# EAGLE design ProtoShield_V4.0 (EAGLE 7.6.0)
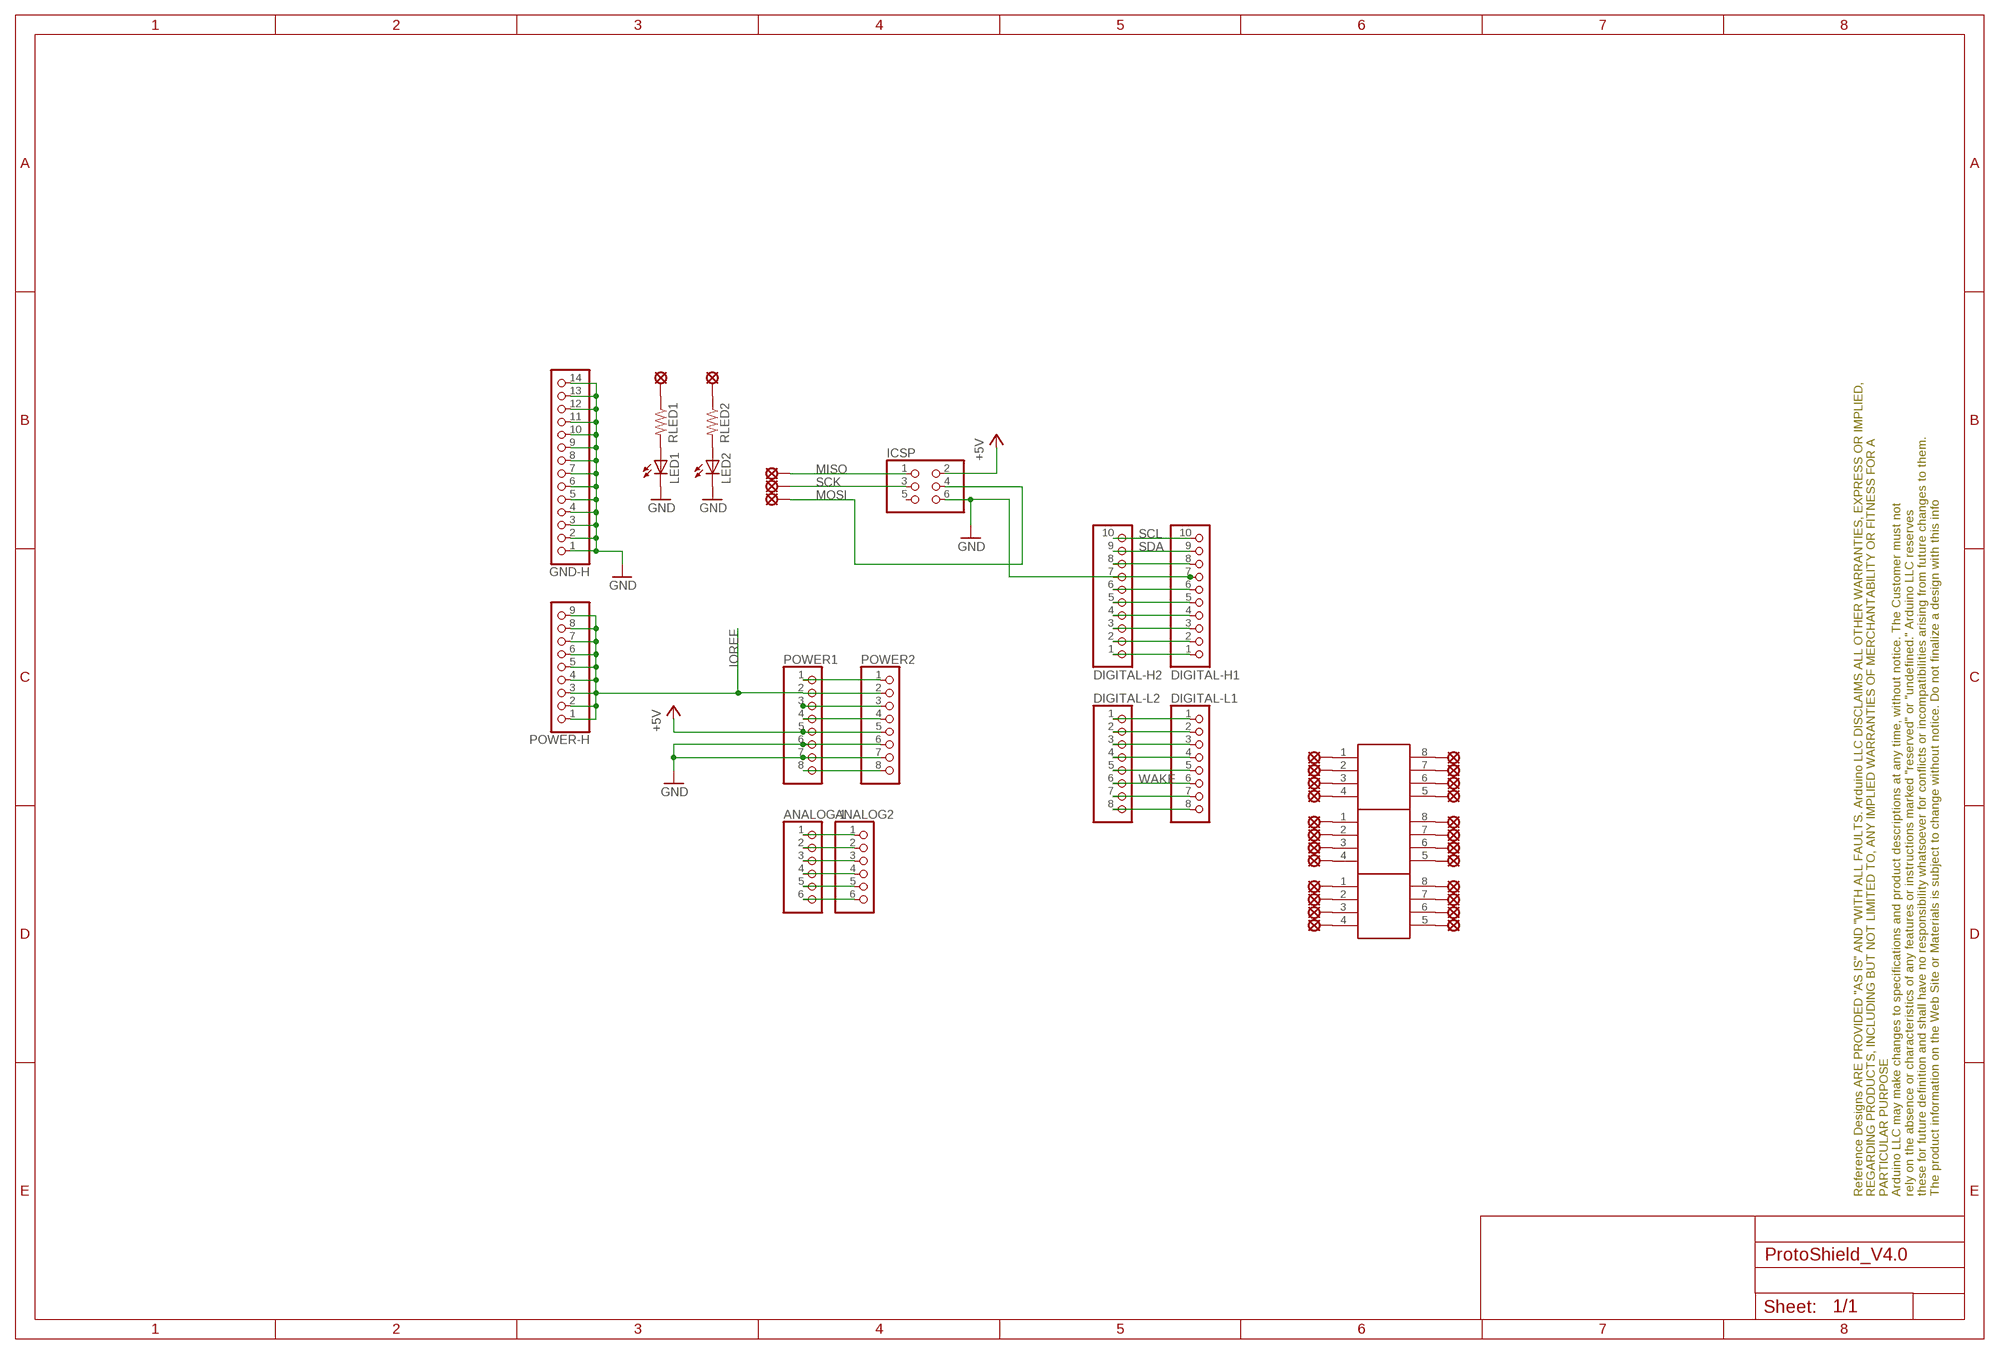
[diagram p0: schematic, sheet 1]

## Parts
ANALOG2  PINHD-1X6  [1X06]
ANALOG-1  PINHD-1X6  [1X06]
DIGITAL-H1  PINHD-1X10TH  [1X10-TH]
DIGITAL-H2  PINHD-1X10TH  [1X10-TH]
DIGITAL-L1  PINHD-1X8  [1X08]
DIGITAL-L2  PINHD-1X8  [1X08]
FRAME1  A3L-LOC  [FRAME]
GND-H  PINHD-1X14  [1X14]
IC1  SMD-8  [SO-8]
IC2  SMD-8  [SO-8]
IC3  SMD-8  [SO-8]
ICSP  PINHD-2X3  [2X03]
LED1  LED3MM  [LED3MM]
LED2  LED3MM  [LED3MM]
MISO  LSP10  [LSP10]
MOSI  LSP10  [LSP10]
P1  LSP10  [LSP10]
P2  LSP10  [LSP10]
P3  LSP10  [LSP10]
P4  LSP10  [LSP10]
P5  LSP10  [LSP10]
P6  LSP10  [LSP10]
P7  LSP10  [LSP10]
P8  LSP10  [LSP10]
P9  LSP10  [LSP10]
P10  LSP10  [LSP10]
P11  LSP10  [LSP10]
P12  LSP10  [LSP10]
P13  LSP10  [LSP10]
P14  LSP10  [LSP10]
P15  LSP10  [LSP10]
P16  LSP10  [LSP10]
P17  LSP10  [LSP10]
P18  LSP10  [LSP10]
P19  LSP10  [LSP10]
P20  LSP10  [LSP10]
P21  LSP10  [LSP10]
P22  LSP10  [LSP10]
P23  LSP10  [LSP10]
P24  LSP10  [LSP10]
PLED1  LSP10  [LSP10]
PLED2  LSP10  [LSP10]
POWER1  PINHD-1X8TH  [1X08-TH]
POWER2  PINHD-1X8TH  [1X08-TH]
POWER-H  PINHD-1X9  [1X9]
RLED1  6MM.3  [R0207/3]
RLED2  6MM.3  [R0207/3]
SCK  LSP10  [LSP10]

## Nets
+5V: ICSP.2 POWER1.5 POWER2.5
GND: DIGITAL-H1.7 DIGITAL-H2.7 GND-H.1 GND-H.2 GND-H.3 GND-H.4 GND-H.5 GND-H.6 GND-H.7 GND-H.8 GND-H.9 GND-H.10 GND-H.11 GND-H.12 GND-H.13 GND-H.14 ICSP.6 LED1.K(C) LED2.K(C) POWER1.7 POWER2.7
IOREF: POWER1.2 POWER2.2 POWER-H.1 POWER-H.2 POWER-H.3 POWER-H.4 POWER-H.5 POWER-H.6 POWER-H.7 POWER-H.8 POWER-H.9
MISO: ICSP.1 MISO.MP
MOSI: ICSP.4 MOSI.MP
N$1: DIGITAL-H1.6 DIGITAL-H2.6
N$2: DIGITAL-H1.1 DIGITAL-H2.1
N$3: DIGITAL-H1.4 DIGITAL-H2.4
N$4: DIGITAL-H1.5 DIGITAL-H2.5
N$5: IC1.1 P1.MP
N$6: DIGITAL-H1.2 DIGITAL-H2.2
N$7: DIGITAL-H1.3 DIGITAL-H2.3
N$8: DIGITAL-L1.1 DIGITAL-L2.1
N$9: DIGITAL-L1.2 DIGITAL-L2.2
N$10: DIGITAL-L1.3 DIGITAL-L2.3
N$11: DIGITAL-L1.4 DIGITAL-L2.4
N$12: DIGITAL-L1.5 DIGITAL-L2.5
N$14: DIGITAL-L1.7 DIGITAL-L2.7
N$15: DIGITAL-L1.8 DIGITAL-L2.8
N$18: ANALOG2.1 ANALOG-1.1
N$19: ANALOG2.2 ANALOG-1.2
N$20: ANALOG2.3 ANALOG-1.3
N$21: ANALOG2.4 ANALOG-1.4
N$22: ANALOG2.5 ANALOG-1.5
N$23: ANALOG2.6 ANALOG-1.6
N$24: IC1.2 P2.MP
N$25: POWER1.6 POWER2.6
N$27: POWER1.3 POWER2.3
N$28: POWER1.8 POWER2.8
N$32: POWER1.1 POWER2.1
N$75: IC1.3 P3.MP
N$76: IC1.4 P4.MP
N$77: IC1.8 P24.MP
N$78: IC1.7 P23.MP
N$90: IC1.6 P22.MP
N$92: IC1.5 P21.MP
N$97: IC2.1 P5.MP
N$98: IC2.2 P6.MP
N$99: IC2.3 P7.MP
N$100: IC2.4 P8.MP
N$101: IC2.8 P20.MP
N$102: IC2.7 P19.MP
N$103: IC2.6 P18.MP
N$104: IC2.5 P17.MP
N$105: IC3.1 P9.MP
N$107: IC3.2 P10.MP
N$109: IC3.3 P11.MP
N$110: IC3.4 P12.MP
N$111: IC3.8 P16.MP
N$112: IC3.7 P15.MP
N$113: IC3.6 P14.MP
N$117: IC3.5 P13.MP
N$134: LED2.A RLED2.2
N$136: LED1.A RLED1.2
N$137: PLED1.MP RLED1.1
N$138: PLED2.MP RLED2.1
N$222: DIGITAL-H1.8 DIGITAL-H2.8
N$223: POWER1.4 POWER2.4
SCK: ICSP.3 SCK.MP
SCL: DIGITAL-H1.10 DIGITAL-H2.10
SDA: DIGITAL-H1.9 DIGITAL-H2.9
WAKE: DIGITAL-L1.6 DIGITAL-L2.6
Unconnected: ICSP.5

## Library data of the parts
ANALOG2 ANALOG-1 = pinhead:PINHD-1X6: PIN HEADER; OC_FARNELL: unknown
DIGITAL-H1 DIGITAL-H2 = SmartPrj:PINHD-1X10: PIN HEADER; OC_FARNELL: unknown
DIGITAL-L1 DIGITAL-L2 = pinhead:PINHD-1X8: PIN HEADER; MF: EPCOS; MPN: B67345B0001X087; OC_FARNELL: 2355112
FRAME1 = Arduino-utility:A3L-LOC: FRAME DIN A3, landscape with location and doc. field
GND-H = Arduino:PINHD-1X14: PIN HEADER; MF: AVX; MPN: 08051C472KAZ2A; OC_FARNELL: 1301896
IC1-IC3 = Arduino:SMD-8; MF: VISHAY BC COMPONENTS; MPN: MAL215374221E3; OC_FARNELL: 1187013
ICSP = SmartPrj:PINHD-2X3: PIN HEADER; MF: CYNERGY3; MPN: SSF22X035; OC_FARNELL: 4249148
LED1 LED2 = led:LED: LED OSRAM: - CHIPLED LG R971, LG N971, LY N971, LG Q971, LY Q971, LO R971, LY R971 LH N974, LH R974 LS Q976, LO Q976, LY Q976 LO Q996 - Hyper CHIPLED LW Q18S LB Q993, LB Q99A, LB R99A - SideLED LS A670, LO A670, LY A670, LG A670, LP A670 LB A673, LV A673, LT A673, LW A673 LH A674 LY A675 LS A676, LA A676, LO A676, LY A676, LW A676 LS A679, LY A679, LG A679 - Hyper Micro SIDELED® LS Y876, LA Y876, LO Y876, LY Y876 LT Y87S - SmartLED LW L88C, LW L88S LB L89C, LB L89S, LG L890 LS L89K, LO L89K, LY L89K LS L896, LA L896, LO L896, LY L896 - TOPLED LS T670, LO T670, LY T670, LG T670, LP T670 LSG T670, LSP T670, LSY T670, LOP T670, LYG T670 LG T671, LOG T671, LSG T671 LB T673, LV T673, LT T673, LW T673 LH T674 LS T676, LA T676, LO T676, LY T676, LB T676, LH T676, LSB T676, LW T676 LB T67C, LV T67C, LT T67C, LS T67K, LO T67K, LY T67K, LW E67C LS E67B, LA E67B, LO E67B, LY E67B, LB E67C, LV E67C, LT E67C LW T67C LS T679, LY T679, LG T679 LS T770, LO T770, LY T770, LG T770, LP T770 LB T773, LV T773, LT T773, LW T773 LH T774 LS E675, LA E675, LY E675, LS T675 LS T776, LA T776, LO T776, LY T776, LB T776 LHGB T686 LT T68C, LB T68C - Hyper Mini TOPLED® LB M676 - Mini TOPLED Santana® LG M470 LS M47K, LO M47K, LY M47K Source: http://www.osram.convergy.de/; MF: DIALIGHT; MPN: 553-0711F; OC_FARNELL: 1519412
MISO MOSI P1-P24 PLED1 PLED2 SCK = SmartPrj:LSP10: SOLDER PAD drill 1.0 mm, distributor Buerklin, 12H555; MF: RICHCO; MPN: MDLSP1-04M-01; OC_FARNELL: 1325982
POWER1 POWER2 = SmartPrj:PINHD-1X8: PIN HEADER; OC_FARNELL: unknown
POWER-H = Arduino:PINHD-1X9: PIN HEADER; MF: CML INNOVATIVE TECHNOLOGIES; MPN: 513LF; OC_FARNELL: 1139445
RLED1 RLED2 = gm-resistors:6MM: 6mm Resistors Leads spaced 1-6 holes apart for 0.1" perfboard. Suitable for 1/4 watt resistors.; OC_FARNELL: unknown

## Board
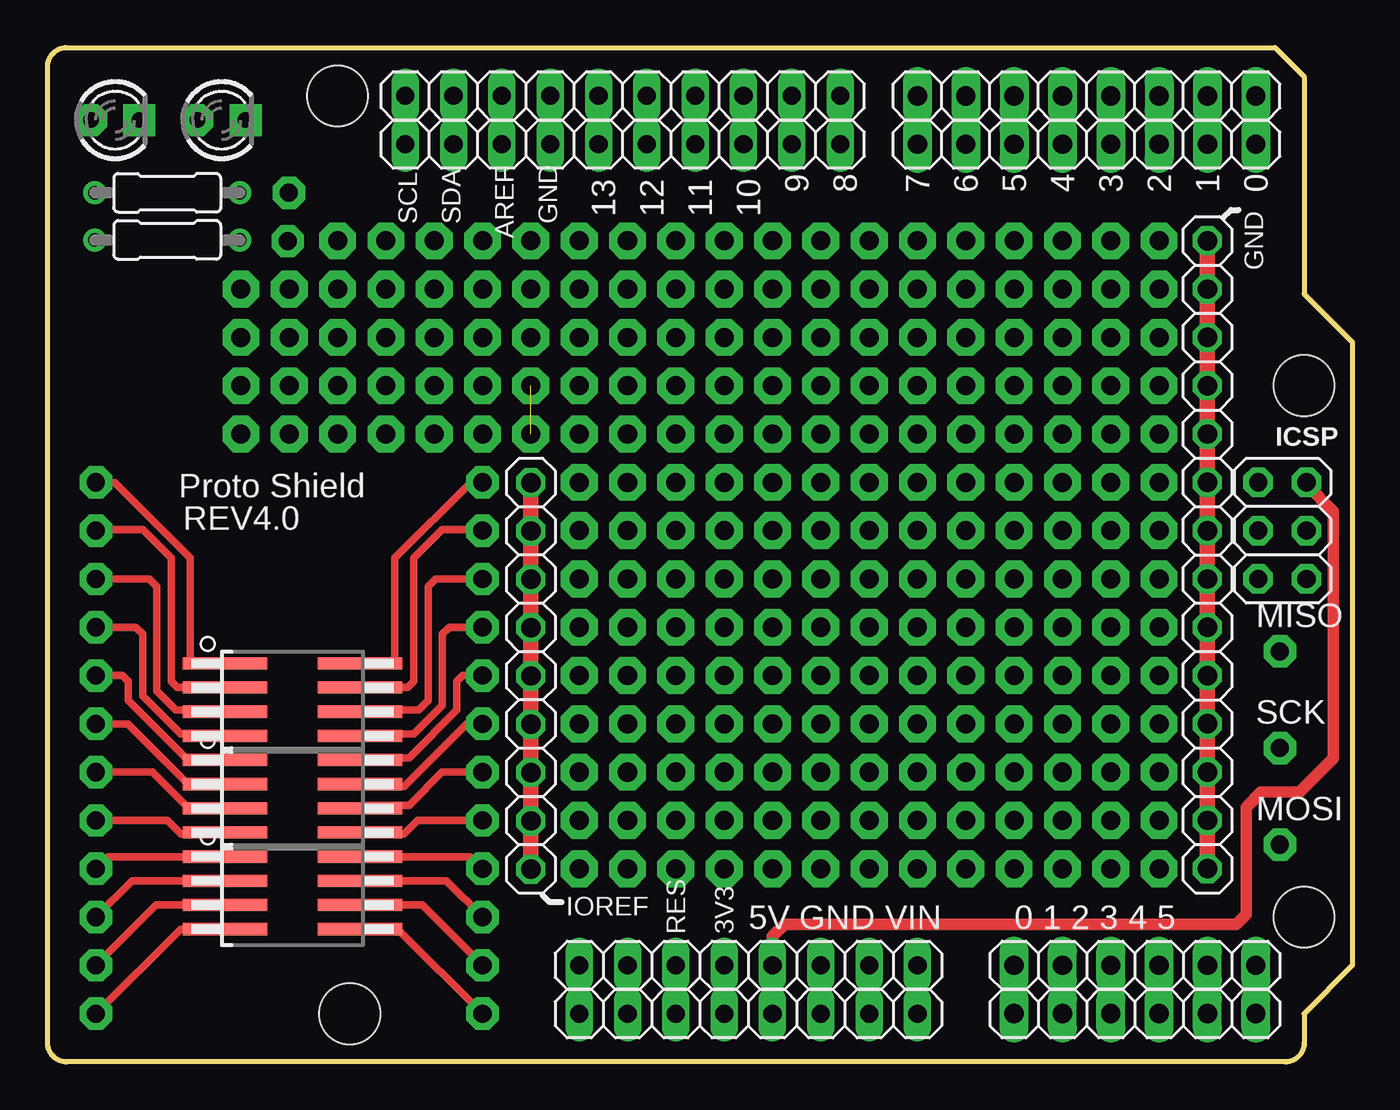
[diagram p1: board, top side]
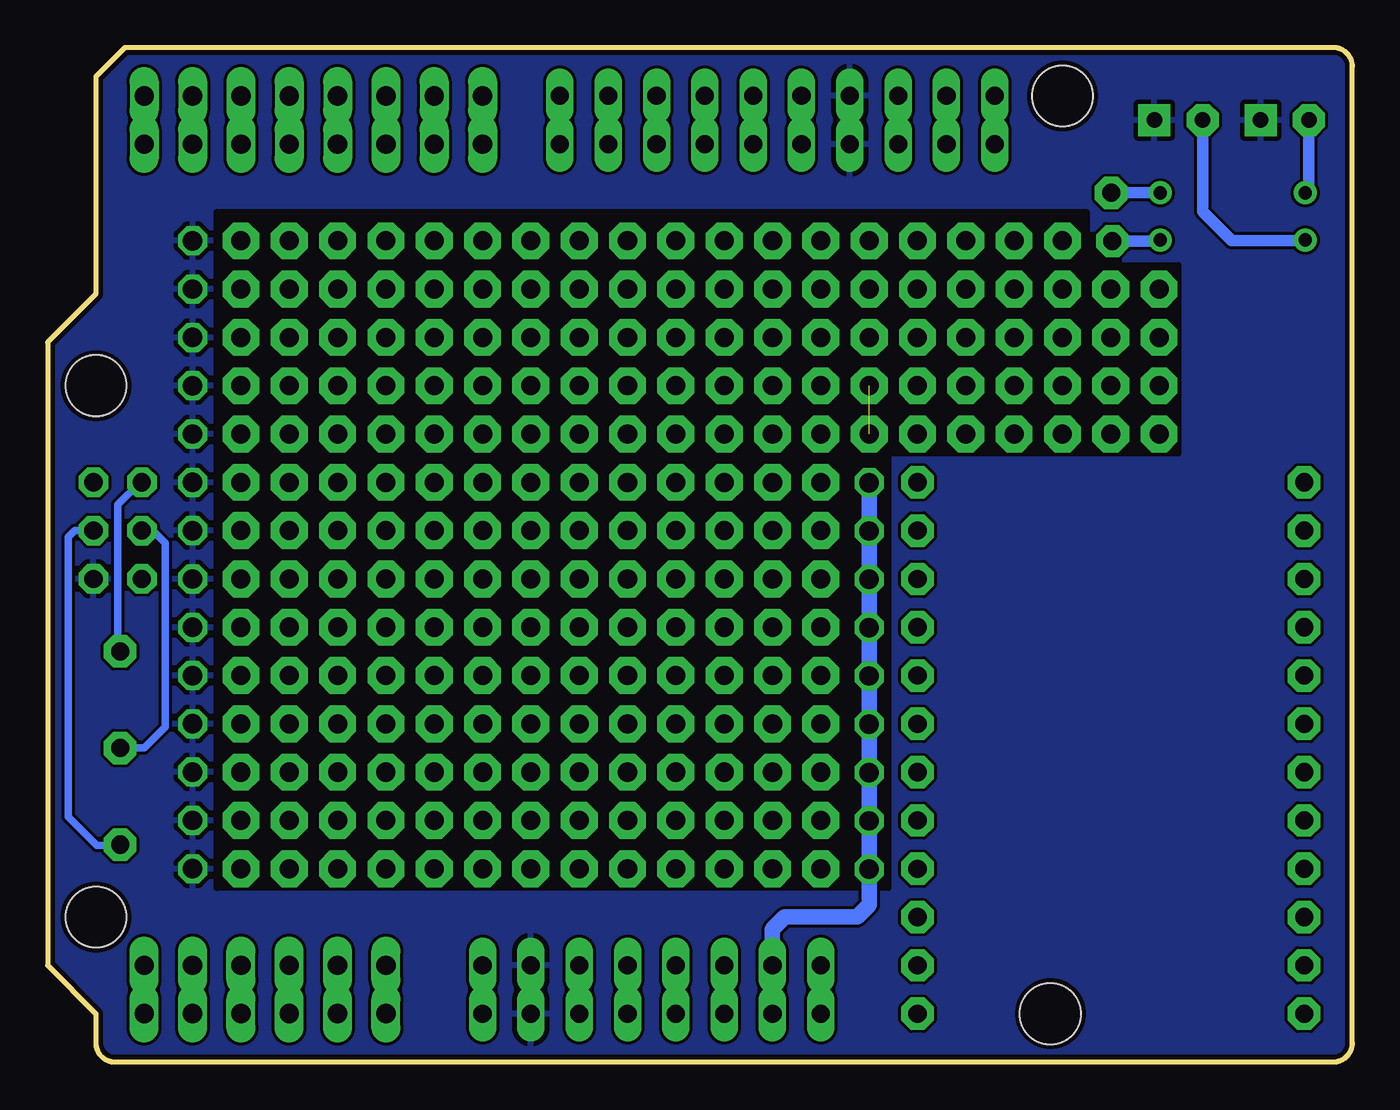
[diagram p2: board, bottom side, seen from below]

Size 68.58 x 53.34 mm. Coordinates in mm from the lower left corner, seen from the top.
Outline: 64.52,53.34 66.04,51.82 66.04,40.39 68.58,37.85 68.58,5.08 66.04,2.54 66.04,1 arc-90 65.04,0 1,0 arc-90 0,1 0,52.34 arc-90 1,53.34 64.52,53.34
Copper layers (1*16): Top 0.035mm / dielectric 1.5mm / Bottom 0.035mm
Design rules "SeeedStudio_2layers": minimum track width 6mil, minimum drill 12mil, track to track 6mil, track to pad 6mil, pad to pad 6mil, via to via 6mil, smd to smd 0mil, copper to edge 10mil, drill to drill 10mil, minimum pad ring 10mil, minimum via ring 6mil, stop-mask expansion 2mil, vias tented up to drill 100mil, thermal gap 10mil
Holes 3.2 mm at 15.24,50.8 66.04,7.62 66.04,35.56 15.88,2.54
bRestrict: 8 lines

### Footprints (pad centres in the part's own frame; a part is rotated, then mirrored left to right if it is on the bottom)
1X06 = drill 1.016 long: 1 -6.35,0; 2 -3.81,0; 3 -1.27,0; 4 1.27,0; 5 3.81,0; 6 6.35,0
1X10-TH = drill 0.95 pad 1.422 long: 1 -11.43,0; 2 -8.89,0; 3 -6.35,0; 4 -3.81,0; 5 -1.27,0; 6 1.27,0; 7 3.81,0; 8 6.35,0; 9 8.89,0; 10 11.43,0
1X08 = drill 1.016 long: 1 -8.89,0; 2 -6.35,0; 3 -3.81,0; 4 -1.27,0; 5 1.27,0; 6 3.81,0; 7 6.35,0; 8 8.89,0
1X14 = drill 1.016 octagon: 1 -16.51,0; 2 -13.97,0; 3 -11.43,0; 4 -8.89,0; 5 -6.35,0; 6 -3.81,0; 7 -1.27,0; 8 1.27,0; 9 3.81,0; 10 6.35,0; 11 8.89,0; 12 11.43,0; 13 13.97,0; 14 16.51,0
SO-8 = smd 0.635 x 4.445: 1 -1.908,-3.383; 2 -0.638,-3.383; 3 0.632,-3.383; 4 1.902,-3.383; 5 1.902,3.729; 6 0.632,3.729; 7 -0.638,3.729; 8 -1.908,3.729
2X03 = drill 0.95 pad 1.55 octagon: 1 -2.54,-1.27; 2 -2.54,1.27; 3 0,-1.27; 4 0,1.27; 5 2.54,-1.27; 6 2.54,1.27
LED3MM = drill 0.813 pad 1.676 octagon: A -1.27,0 | drill 0.813 pad 1.676 square: K 1.27,0
LSP10 = drill 0.95 pad 1.7 octagon: MP 0,0
1X08-TH = drill 0.95 pad 1.422 long: 1 -8.89,0; 2 -6.35,0; 3 -3.81,0; 4 -1.27,0; 5 1.27,0; 6 3.81,0; 7 6.35,0; 8 8.89,0
1X9 = drill 1.016 octagon: 1 -10.16,0; 2 -7.62,0; 3 -5.08,0; 4 -2.54,0; 5 0,0; 6 2.54,0; 7 5.08,0; 8 7.62,0; 9 10.16,0
R0207/3 = drill 0.7: 1 -3.81,0; 2 3.81,0

### Placement (x,y rotation side)
ANALOG2  57.15,5.08 0 top
ANALOG-1  57.15,2.54 0 top
DIGITAL-H1  30.23,48.26 180 top
DIGITAL-H2  30.23,50.8 180 top
DIGITAL-L1  54.61,48.26 180 top
DIGITAL-L2  54.61,50.8 180 top
FRAME1  -25.06,-1.25 0 top  (outside the outline)
GND-H  60.96,26.67 90 top
IC1  12.7,19.05 270 top
IC2  12.7,13.97 270 top
IC3  12.7,8.89 270 top
ICSP  64.9,27.94 270 top
LED1  9.14,49.53 0 top
LED2  3.56,49.53 0 top
MISO  64.77,21.59 0 top
MOSI  64.77,11.43 0 top
P1  2.54,30.48 0 top
P2  2.54,27.94 0 top
P3  2.54,25.4 0 top
P4  2.54,22.86 0 top
P5  2.54,20.32 0 top
P6  2.54,17.78 0 top
P7  2.54,15.24 0 top
P8  2.54,12.7 0 top
P9  2.54,10.16 0 top
P10  2.54,7.62 0 top
P11  2.54,5.08 0 top
P12  2.54,2.54 0 top
P13  22.86,2.54 0 top
P14  22.86,5.08 0 top
P15  22.86,7.62 0 top
P16  22.86,10.16 0 top
P17  22.86,12.7 0 top
P18  22.86,15.24 0 top
P19  22.86,17.78 0 top
P20  22.86,20.32 0 top
P21  22.86,22.86 0 top
P22  22.86,25.4 0 top
P23  22.86,27.94 0 top
P24  22.86,30.48 0 top
PLED1  12.62,43.16 0 top
PLED2  12.68,45.7 0 top
POWER1  36.83,5.08 0 top
POWER2  36.83,2.54 0 top
POWER-H  25.4,20.3 270 top
RLED1  6.29,43.22 180 top
RLED2  6.29,45.7 180 top
SCK  64.77,16.51 0 top

### Tracks (layer width: path | path; a pad name or v marks a point on that pad's centre or on a via)
+5V
  Top 0.61: ICSP.2 66.17,30.35 67.56,28.96 67.56,15.96 65.8,14.2 63.8,14.2 63,13.4 63,7.75 62.48,7.24 38.73,7.24 38.1,6.6 POWER1.5
  Bottom 0.61: 38.1,5.71 POWER1.5
  Bottom 0.813: POWER1.5 POWER2.5
GND
  Top 0.813: GND-H.14 GND-H.1
  Bottom 0.61: DIGITAL-H1.7 DIGITAL-H2.7 | POWER1.7 POWER2.7
  pour Bottom: -1.27,54.61 69.85,54.61 69.85,-2.54 -1.27,-2.54
IOREF  (1 unrouted)
  Top 0.813: 25.4,10.16 25.4,30.48
  Bottom 0.406: POWER-H.1 25.4,30.99
  Bottom 0.813: POWER2.2 POWER1.2 30.48,6.99 29.84,7.62 26.04,7.62 25.4,8.26 POWER-H.9 POWER-H.8 POWER-H.7 POWER-H.6 POWER-H.5 POWER-H.4 POWER-H.3 POWER-H.2 POWER-H.1
MISO
  Bottom 0.406: ICSP.1 63.72,30.48 64.9,29.3 64.9,21.8 64.6,21.5 64.86,21.5 MISO.MP
MOSI
  Bottom 0.406: ICSP.4 67.16,27.94 67.5,27.6 67.5,12.9 66,11.4 64.8,11.4 MOSI.MP
N$1
  Bottom 0.813: DIGITAL-H1.6 DIGITAL-H2.6
N$2
  Bottom 0.813: DIGITAL-H1.1 DIGITAL-H2.1
N$3
  Bottom 0.813: DIGITAL-H1.4 DIGITAL-H2.4
N$4
  Bottom 0.813: DIGITAL-H1.5 DIGITAL-H2.5
N$5
  Top 0.406: P1.MP 3.52,30.48 7.5,26.5 7.5,21.25 7.75,21 9.28,21 IC1.1
N$6
  Bottom 0.813: DIGITAL-H1.2 DIGITAL-H2.2
N$7
  Bottom 0.813: DIGITAL-H1.3 DIGITAL-H2.3
N$8
  Bottom 0.813: DIGITAL-L1.1 DIGITAL-L2.1
N$9
  Bottom 0.813: DIGITAL-L1.2 DIGITAL-L2.2
N$10
  Bottom 0.813: DIGITAL-L1.3 DIGITAL-L2.3
N$11
  Bottom 0.813: DIGITAL-L1.4 DIGITAL-L2.4
N$12
  Bottom 0.813: DIGITAL-L1.5 DIGITAL-L2.5
N$14
  Bottom 0.813: DIGITAL-L1.7 DIGITAL-L2.7
N$15
  Bottom 0.813: DIGITAL-L1.8 DIGITAL-L2.8
N$16  (via drill 1 pad 1.93)
  other vias: 50.8,30.48
N$17  (via drill 1 pad 1.93)
  other vias: 53.34,22.86
N$18
  Bottom 0.813: ANALOG-1.1 ANALOG2.1
N$19
  Bottom 0.813: ANALOG-1.2 ANALOG2.2
N$20
  Bottom 0.813: ANALOG-1.3 ANALOG2.3
N$21
  Bottom 0.813: ANALOG-1.4 ANALOG2.4
N$22
  Bottom 0.813: ANALOG-1.5 ANALOG2.5
N$23
  Bottom 0.813: ANALOG-1.6 ANALOG2.6
N$24
  Top 0.406: P2.MP 2.6,28 5,28 6.5,26.5 6.5,20 6.81,19.69 IC1.2
N$25
  Bottom 0.813: POWER2.6 POWER1.6
N$26  (via drill 1 pad 1.93)
  other vias: 53.34,27.94
N$27
  Bottom 0.813: POWER1.3 POWER2.3
N$28
  Bottom 0.813: POWER2.8 POWER1.8
N$29  (via drill 1 pad 1.93)
  other vias: 12.7,33.02
N$31  (via drill 1 pad 1.93)
  other vias: 12.7,35.56
N$32
  Bottom 0.813: POWER2.1 POWER1.1
N$33  (via drill 1 pad 1.93)
  other vias: 12.7,38.1
N$34  (via drill 1 pad 1.93)
  other vias: 12.7,40.64
N$36  (via drill 1 pad 1.93)
  other vias: 15.24,38.1
N$37  (via drill 1 pad 1.93)
  other vias: 17.78,38.1
N$38  (via drill 1 pad 1.93)
  other vias: 50.8,25.4
N$39  (via drill 1 pad 1.93)
  other vias: 15.24,35.56
N$40  (via drill 1 pad 1.93)
  other vias: 17.78,35.56
N$41  (via drill 1 pad 1.93)
  other vias: 15.24,33.02
N$42  (via drill 1 pad 1.93)
  other vias: 17.78,33.02
N$43  (via drill 1 pad 1.93)
  other vias: 20.32,35.56
N$44  (via drill 1 pad 1.93)
  other vias: 20.32,33.02
N$45  (via drill 1 pad 1.93)
  other vias: 45.72,10.16
N$46  (via drill 1 pad 1.93)
  other vias: 27.94,10.16
N$47  (via drill 1 pad 1.93)
  other vias: 22.86,33.02
N$48  (via drill 1 pad 1.93)  (1 unrouted)
  other vias: 25.4,35.56 25.4,33.02
N$49  (via drill 1 pad 1.93)
  other vias: 50.8,27.94
N$50  (via drill 1 pad 1.93)
  other vias: 58.42,25.4
N$51  (via drill 1 pad 1.93)
  other vias: 22.86,35.56
N$52  (via drill 1 pad 1.93)
  other vias: 55.88,22.86
N$53  (via drill 1 pad 1.93)
  other vias: 53.34,25.4
N$54  (via drill 1 pad 1.93)
  other vias: 25.4,38.1
N$55  (via drill 1 pad 1.93)
  other vias: 20.32,38.1
N$56  (via drill 1 pad 1.93)
  other vias: 20.32,40.64
N$57  (via drill 1 pad 1.93)
  other vias: 53.34,12.7
N$58  (via drill 1 pad 1.93)
  other vias: 27.94,12.7
N$59  (via drill 1 pad 1.93)
  other vias: 17.78,40.64
N$60  (via drill 1 pad 1.93)
  other vias: 15.24,40.64
N$61  (via drill 1 pad 1.93)
  other vias: 15.24,43.18
N$62  (via drill 1 pad 1.93)
  other vias: 17.78,43.18
N$63  (via drill 1 pad 1.93)
  other vias: 35.56,27.94
N$64  (via drill 1 pad 1.93)
  other vias: 35.56,25.4
N$65  (via drill 1 pad 1.93)
  other vias: 22.86,38.1
N$66  (via drill 1 pad 1.93)
  other vias: 25.4,40.64
N$67  (via drill 1 pad 1.93)
  other vias: 22.86,40.64
N$68  (via drill 1 pad 1.93)
  other vias: 22.86,43.18
N$69  (via drill 1 pad 1.93)
  other vias: 43.18,15.24
N$70  (via drill 1 pad 1.93)
  other vias: 27.94,15.24
N$71  (via drill 1 pad 1.93)
  other vias: 25.4,43.18
N$72  (via drill 1 pad 1.93)
  other vias: 20.32,43.18
N$75
  Top 0.406: P3.MP 5.35,25.4 5.75,25 5.75,19.5 6.75,18.5 9.23,18.5 IC1.3
N$76
  Top 0.406: P4.MP 4.64,22.86 5,22.5 5,19.25 7,17.25 9.21,17.25 IC1.4
N$77
  Top 0.406: P24.MP 22.23,30.48 18.25,26.5 18.25,21.25 18,21 16.47,21 IC1.8
N$78
  Top 0.406: IC1.7 18.94,19.69 19.25,20 19.25,26.5 20.75,28 22.8,28 P23.MP
N$79  (via drill 1 pad 1.93)
  other vias: 10.16,38.1
N$80  (via drill 1 pad 1.93)
  other vias: 55.88,30.48
N$81  (via drill 1 pad 1.93)
  other vias: 58.42,17.78
N$82  (via drill 1 pad 1.93)
  other vias: 27.94,17.78
N$83  (via drill 1 pad 1.93)
  other vias: 10.16,35.56
N$85  (via drill 1 pad 1.93)
  other vias: 10.16,33.02
N$87  (via drill 1 pad 1.93)
  other vias: 10.16,40.64
N$88  (via drill 1 pad 1.93)
  other vias: 38.1,27.94
N$89  (via drill 1 pad 1.93)
  other vias: 40.64,25.4
N$90
  Top 0.406: P22.MP 20.4,25.4 20,25 20,19 19.5,18.5 16.51,18.5 IC1.6
N$91  (via drill 1 pad 1.93)
  other vias: 43.18,27.94
N$92
  Top 0.406: P21.MP 21.11,22.86 20.75,22.5 20.75,18.75 19.25,17.25 16.53,17.25 IC1.5
N$94  (via drill 1 pad 1.93)
  other vias: 27.94,20.32
N$96  (via drill 1 pad 1.93)
  other vias: 45.72,27.94
N$97
  Top 0.406: P5.MP 3.93,20.32 4.25,20 4.25,19 7.5,15.75 9.19,15.75 IC2.1
N$98
  Top 0.406: P6.MP 4.22,17.78 7.5,14.5 9.21,14.5 IC2.2
N$99
  Top 0.406: P7.MP 5.51,15.24 7.5,13.25 9.23,13.25 IC2.3
N$100
  Top 0.406: P8.MP 6.3,12.7 7,12 9.25,12 IC2.4
N$101
  Top 0.406: P20.MP 21.82,20.32 21.5,20 21.5,18.5 19,16 16.55,16 IC2.8
N$102
  Top 0.406: P19.MP 22.03,17.78 18.75,14.5 16.54,14.5 IC2.7
N$103
  Top 0.406: P18.MP 20.74,15.24 19,13.5 16.59,13.5 IC2.6
N$104
  Top 0.406: P17.MP 19.45,12.7 18.75,12 16.5,12 IC2.5
N$105
  Top 0.406: IC3.1 3.18,10.8 P9.MP
N$106  (via drill 1 pad 1.93)
  other vias: 27.94,22.86
N$107
  Top 0.406: IC3.2 4.45,9.53 P10.MP
N$108  (via drill 1 pad 1.93)
  other vias: 48.26,25.4
N$109
  Top 0.406: IC3.3 5.72,8.26 P11.MP
N$110
  Top 0.406: IC3.4 6.99,6.99 P12.MP
N$111
  Top 0.406: IC3.8 22.22,10.8 P16.MP
N$112
  Top 0.406: IC3.7 20.95,9.53 P15.MP
N$113
  Top 0.406: IC3.6 19.68,8.26 P14.MP
N$117
  Top 0.406: IC3.5 18.41,6.99 P13.MP
N$119  (via drill 1 pad 1.93)
  other vias: 27.94,25.4
N$123  (via drill 1 pad 1.93)
  other vias: 48.26,27.94
N$131  (via drill 1 pad 1.93)
  other vias: 27.94,27.94
N$132  (via drill 1 pad 1.93)
  other vias: 33.02,27.94
N$134
  Bottom 0.61: 2.54,45.76 RLED2.2 2.29,45.89 LED2.A
N$135  (via drill 1 pad 1.93)
  other vias: 33.02,25.4
N$136
  Bottom 0.61: RLED1.2 2.52,43.18 6.35,43.18 7.87,44.7 LED1.A
N$137
  Bottom 0.61: PLED1.MP 10.1,43.16 RLED1.1
N$138
  Bottom 0.61: PLED2.MP RLED2.1
N$139  (via drill 1 pad 1.93)
  other vias: 55.88,27.94
N$140  (via drill 1 pad 1.93)
  other vias: 58.42,27.94
N$143  (via drill 1 pad 1.93)
  other vias: 27.94,30.48
N$145  (via drill 1 pad 1.93)
  other vias: 55.88,25.4
N$153  (via drill 1 pad 1.93)
  other vias: 55.88,33.02
N$155  (via drill 1 pad 1.93)
  other vias: 27.94,33.02
N$156  (via drill 1 pad 1.93)
  other vias: 38.1,25.4
N$165  (via drill 1 pad 1.93)
  other vias: 50.8,35.56
N$167  (via drill 1 pad 1.93)
  other vias: 27.94,35.56
N$168  (via drill 1 pad 1.93)
  other vias: 40.64,27.94
N$177  (via drill 1 pad 1.93)
  other vias: 43.18,38.1
N$179  (via drill 1 pad 1.93)
  other vias: 27.94,38.1
N$180  (via drill 1 pad 1.93)
  other vias: 43.18,25.4
N$191  (via drill 1 pad 1.93)
  other vias: 27.94,40.64
N$192  (via drill 1 pad 1.93)
  other vias: 45.72,25.4
N$201  (via drill 1 pad 1.93)
  other vias: 38.1,43.18
N$203  (via drill 1 pad 1.93)
  other vias: 27.94,43.18
N$222
  Bottom 0.813: DIGITAL-H1.8 DIGITAL-H2.8
N$223
  Bottom 0.813: POWER2.4 POWER1.4
N$227  (via drill 1 pad 1.93)
  other vias: 30.48,38.1
N$228  (via drill 1 pad 1.93)
  other vias: 33.02,38.1
N$229  (via drill 1 pad 1.93)
  other vias: 30.48,35.56
N$230  (via drill 1 pad 1.93)
  other vias: 33.02,35.56
N$231  (via drill 1 pad 1.93)
  other vias: 30.48,33.02
N$232  (via drill 1 pad 1.93)
  other vias: 33.02,33.02
N$233  (via drill 1 pad 1.93)
  other vias: 35.56,35.56
N$234  (via drill 1 pad 1.93)
  other vias: 35.56,33.02
N$235  (via drill 1 pad 1.93)
  other vias: 33.02,30.48
N$236  (via drill 1 pad 1.93)
  other vias: 35.56,30.48
N$237  (via drill 1 pad 1.93)
  other vias: 38.1,33.02
N$238  (via drill 1 pad 1.93)
  other vias: 38.1,35.56
N$239  (via drill 1 pad 1.93)
  other vias: 38.1,30.48
N$240  (via drill 1 pad 1.93)
  other vias: 40.64,33.02
N$241  (via drill 1 pad 1.93)
  other vias: 40.64,35.56
N$242  (via drill 1 pad 1.93)
  other vias: 38.1,38.1
N$243  (via drill 1 pad 1.93)
  other vias: 35.56,38.1
N$245  (via drill 1 pad 1.93)
  other vias: 33.02,40.64
N$246  (via drill 1 pad 1.93)
  other vias: 35.56,40.64
N$247  (via drill 1 pad 1.93)
  other vias: 30.48,40.64
N$248  (via drill 1 pad 1.93)
  other vias: 30.48,43.18
N$249  (via drill 1 pad 1.93)
  other vias: 33.02,43.18
N$251  (via drill 1 pad 1.93)
  other vias: 30.48,30.48
N$252  (via drill 1 pad 1.93)
  other vias: 30.48,27.94
N$259  (via drill 1 pad 1.93)
  other vias: 33.02,22.86
N$261  (via drill 1 pad 1.93)
  other vias: 35.56,22.86
N$262  (via drill 1 pad 1.93)
  other vias: 38.1,22.86
N$263  (via drill 1 pad 1.93)
  other vias: 40.64,22.86
N$267  (via drill 1 pad 1.93)
  other vias: 43.18,30.48
N$268  (via drill 1 pad 1.93)
  other vias: 40.64,30.48
N$269  (via drill 1 pad 1.93)
  other vias: 45.72,30.48
N$271  (via drill 1 pad 1.93)
  other vias: 30.48,25.4
N$272  (via drill 1 pad 1.93)
  other vias: 30.48,22.86
N$273  (via drill 1 pad 1.93)
  other vias: 30.48,20.32
N$274  (via drill 1 pad 1.93)
  other vias: 33.02,15.24
N$275  (via drill 1 pad 1.93)
  other vias: 33.02,17.78
N$276  (via drill 1 pad 1.93)
  other vias: 38.1,17.78
N$277  (via drill 1 pad 1.93)
  other vias: 35.56,17.78
N$278  (via drill 1 pad 1.93)
  other vias: 35.56,15.24
N$279  (via drill 1 pad 1.93)
  other vias: 30.48,15.24
N$280  (via drill 1 pad 1.93)
  other vias: 30.48,17.78
N$281  (via drill 1 pad 1.93)
  other vias: 38.1,20.32
N$282  (via drill 1 pad 1.93)
  other vias: 40.64,20.32
N$283  (via drill 1 pad 1.93)
  other vias: 38.1,15.24
N$284  (via drill 1 pad 1.93)
  other vias: 30.48,12.7
N$285  (via drill 1 pad 1.93)
  other vias: 33.02,12.7
N$286  (via drill 1 pad 1.93)
  other vias: 30.48,10.16
N$289  (via drill 1 pad 1.93)
  other vias: 33.02,10.16
N$290  (via drill 1 pad 1.93)
  other vias: 35.56,10.16
N$291  (via drill 1 pad 1.93)
  other vias: 35.56,12.7
N$292  (via drill 1 pad 1.93)
  other vias: 38.1,12.7
N$293  (via drill 1 pad 1.93)
  other vias: 40.64,17.78
N$294  (via drill 1 pad 1.93)
  other vias: 43.18,17.78
N$295  (via drill 1 pad 1.93)
  other vias: 43.18,20.32
N$296  (via drill 1 pad 1.93)
  other vias: 45.72,20.32
N$297  (via drill 1 pad 1.93)
  other vias: 45.72,22.86
N$298  (via drill 1 pad 1.93)
  other vias: 43.18,22.86
N$299  (via drill 1 pad 1.93)
  other vias: 48.26,22.86
N$304  (via drill 1 pad 1.93)
  other vias: 53.34,30.48
N$305  (via drill 1 pad 1.93)
  other vias: 48.26,30.48
N$307  (via drill 1 pad 1.93)
  other vias: 45.72,33.02
N$309  (via drill 1 pad 1.93)
  other vias: 50.8,33.02
N$310  (via drill 1 pad 1.93)
  other vias: 48.26,33.02
N$311  (via drill 1 pad 1.93)
  other vias: 43.18,33.02
N$312  (via drill 1 pad 1.93)
  other vias: 43.18,35.56
N$313  (via drill 1 pad 1.93)
  other vias: 45.72,35.56
N$314  (via drill 1 pad 1.93)
  other vias: 33.02,20.32
N$315  (via drill 1 pad 1.93)
  other vias: 35.56,20.32
N$316  (via drill 1 pad 1.93)
  other vias: 45.72,17.78
N$317  (via drill 1 pad 1.93)
  other vias: 48.26,20.32
N$318  (via drill 1 pad 1.93)
  other vias: 50.8,20.32
N$319  (via drill 1 pad 1.93)
  other vias: 50.8,22.86
N$320  (via drill 1 pad 1.93)
  other vias: 55.88,20.32
N$327  (via drill 1 pad 1.93)
  other vias: 58.42,12.7
N$354  (via drill 1 pad 1.93)
  other vias: 58.42,10.16
N$355  (via drill 1 pad 1.93)
  other vias: 55.88,10.16
N$356  (via drill 1 pad 1.93)
  other vias: 53.34,10.16
N$357  (via drill 1 pad 1.93)
  other vias: 50.8,10.16
N$358  (via drill 1 pad 1.93)
  other vias: 48.26,10.16
N$359  (via drill 1 pad 1.93)
  other vias: 40.64,10.16
N$360  (via drill 1 pad 1.93)
  other vias: 38.1,10.16
N$361  (via drill 1 pad 1.93)
  other vias: 43.18,10.16
N$362  (via drill 1 pad 1.93)
  other vias: 43.18,12.7
N$363  (via drill 1 pad 1.93)
  other vias: 40.64,12.7
N$364  (via drill 1 pad 1.93)
  other vias: 45.72,12.7
N$365  (via drill 1 pad 1.93)
  other vias: 48.26,12.7
N$366  (via drill 1 pad 1.93)
  other vias: 55.88,12.7
N$367  (via drill 1 pad 1.93)
  other vias: 50.8,12.7
N$369  (via drill 1 pad 1.93)
  other vias: 58.42,15.24
N$370  (via drill 1 pad 1.93)
  other vias: 55.88,15.24
N$371  (via drill 1 pad 1.93)
  other vias: 53.34,15.24
N$372  (via drill 1 pad 1.93)
  other vias: 50.8,15.24
N$373  (via drill 1 pad 1.93)
  other vias: 48.26,15.24
N$374  (via drill 1 pad 1.93)
  other vias: 45.72,15.24
N$375  (via drill 1 pad 1.93)
  other vias: 40.64,15.24
N$376  (via drill 1 pad 1.93)
  other vias: 48.26,17.78
N$377  (via drill 1 pad 1.93)
  other vias: 50.8,17.78
N$378  (via drill 1 pad 1.93)
  other vias: 53.34,17.78
N$379  (via drill 1 pad 1.93)
  other vias: 55.88,17.78
N$380  (via drill 1 pad 1.93)
  other vias: 58.42,20.32
N$381  (via drill 1 pad 1.93)
  other vias: 53.34,20.32
N$383  (via drill 1 pad 1.93)
  other vias: 58.42,22.86
N$395  (via drill 1 pad 1.93)
  other vias: 58.42,30.48
N$399  (via drill 1 pad 1.93)
  other vias: 58.42,33.02
N$400  (via drill 1 pad 1.93)
  other vias: 53.34,33.02
N$402  (via drill 1 pad 1.93)
  other vias: 58.42,35.56
N$406  (via drill 1 pad 1.93)
  other vias: 58.42,38.1
N$407  (via drill 1 pad 1.93)
  other vias: 55.88,38.1
N$408  (via drill 1 pad 1.93)
  other vias: 55.88,35.56
N$409  (via drill 1 pad 1.93)
  other vias: 53.34,38.1
N$410  (via drill 1 pad 1.93)
  other vias: 53.34,35.56
N$411  (via drill 1 pad 1.93)
  other vias: 48.26,35.56
N$412  (via drill 1 pad 1.93)
  other vias: 50.8,38.1
N$413  (via drill 1 pad 1.93)
  other vias: 48.26,38.1
N$414  (via drill 1 pad 1.93)
  other vias: 45.72,38.1
N$415  (via drill 1 pad 1.93)
  other vias: 40.64,38.1
N$416  (via drill 1 pad 1.93)
  other vias: 38.1,40.64
N$417  (via drill 1 pad 1.93)
  other vias: 43.18,40.64
N$418  (via drill 1 pad 1.93)
  other vias: 40.64,40.64
N$419  (via drill 1 pad 1.93)
  other vias: 45.72,40.64
N$420  (via drill 1 pad 1.93)
  other vias: 48.26,40.64
N$421  (via drill 1 pad 1.93)
  other vias: 50.8,40.64
N$422  (via drill 1 pad 1.93)
  other vias: 53.34,40.64
N$423  (via drill 1 pad 1.93)
  other vias: 55.88,40.64
N$424  (via drill 1 pad 1.93)
  other vias: 58.42,40.64
N$428  (via drill 1 pad 1.93)
  other vias: 58.42,43.18
N$429  (via drill 1 pad 1.93)
  other vias: 55.88,43.18
N$430  (via drill 1 pad 1.93)
  other vias: 50.8,43.18
N$431  (via drill 1 pad 1.93)
  other vias: 53.34,43.18
N$432  (via drill 1 pad 1.93)
  other vias: 48.26,43.18
N$433  (via drill 1 pad 1.93)
  other vias: 45.72,43.18
N$434  (via drill 1 pad 1.93)
  other vias: 43.18,43.18
N$435  (via drill 1 pad 1.93)
  other vias: 40.64,43.18
N$436  (via drill 1 pad 1.93)
  other vias: 35.56,43.18
SCK
  Bottom 0.406: ICSP.3 63.04,27.94 62.4,27.3 62.4,17.61 63.5,16.51 SCK.MP
SCL
  Bottom 0.813: DIGITAL-H1.10 DIGITAL-H2.10
SDA
  Bottom 0.813: DIGITAL-H1.9 DIGITAL-H2.9
WAKE
  Bottom 0.813: DIGITAL-L1.6 DIGITAL-L2.6

### Text on the board
tPlace: 9 | 8 | 7 | 6 | 5 | 4 | 3 | 2 | 1 | 0 | 13 | 12 | 11 | 10 | Proto Shield | REV4.0
tNames: GND | SCL | SDA | GND | AREF | IOREF | RES | 3V3 | 5V GND VIN | 0 1 2 3 4 5